# EAGLE design untitled (EAGLE 7.2.0)
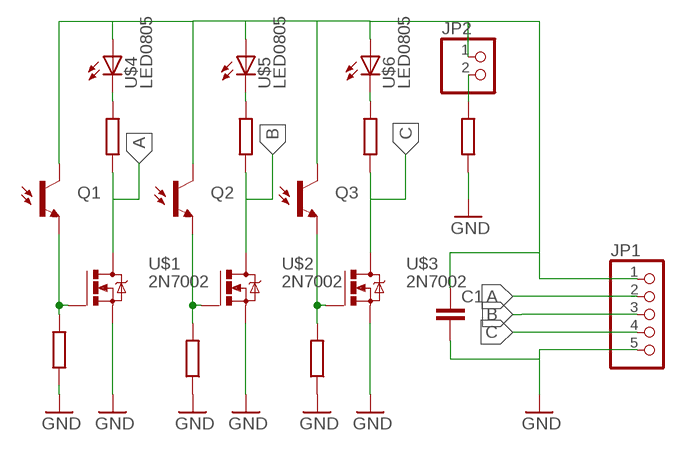
[diagram p0: schematic, sheet 1]

## Parts
C1  CC0805  [C0805]
JP1  PINHD-1X5  [1X05]
JP2  PINHD-1X2  [1X02]
Q1  PHOTOTRANSISTORPT17-21C-L41-TR8  [PT17-21C-L41-TR8]
Q2  PHOTOTRANSISTORPT17-21C-L41-TR8  [PT17-21C-L41-TR8]
Q3  PHOTOTRANSISTORPT17-21C-L41-TR8  [PT17-21C-L41-TR8]
R1  R0805  [R0805]
R4  R0805  [R0805]
R5  R0805  [R0805]
R6  R0805  [R0805]
R7  R0805  [R0805]
R8  R0805  [R0805]
R9  R0805  [R0805]
U$1  2N7002  [SOT23]
U$2  2N7002  [SOT23]
U$3  2N7002  [SOT23]
U$4  LED0805  [0805-LED]
U$5  LED0805  [0805-LED]
U$6  LED0805  [0805-LED]

## Nets
A: JP1.2 R7.1 U$1.3(D)
B: JP1.3 R8.1 U$2.3(D)
C: JP1.4 R9.1 U$3.3(D)
GND: C1.2 JP1.5 R1.1 R4.1 R5.1 R6.1 U$1.2(S) U$2.2(S) U$3.2(S)
N$3: C1.1 JP1.1 JP2.1 Q1.C Q2.C Q3.C U$4.A U$5.A U$6.A
N$4: Q1.E R4.2 U$1.1(G)
N$5: Q2.E R5.2 U$2.1(G)
N$6: Q3.E R6.2 U$3.1(G)
N$8: JP2.2 R1.2
N$11: R7.2 U$4.C
N$12: R8.2 U$5.C
N$13: R9.2 U$6.C

## Library data of the parts
C1 = CasaLibrary:C: Capacitor
JP1 = pinhead:PINHD-1X5: PIN HEADER
JP2 = pinhead:PINHD-1X2: PIN HEADER
Q1-Q3 = SparkFun-DiscreteSemi:PHOTOTRANSISTOR; PROD_ID: TRANS-12141
R1 R4-R9 = CasaLibrary:R
U$1-U$3 = CasaLibrary:2N7002
U$4-U$6 = CasaLibrary:LED

## Board
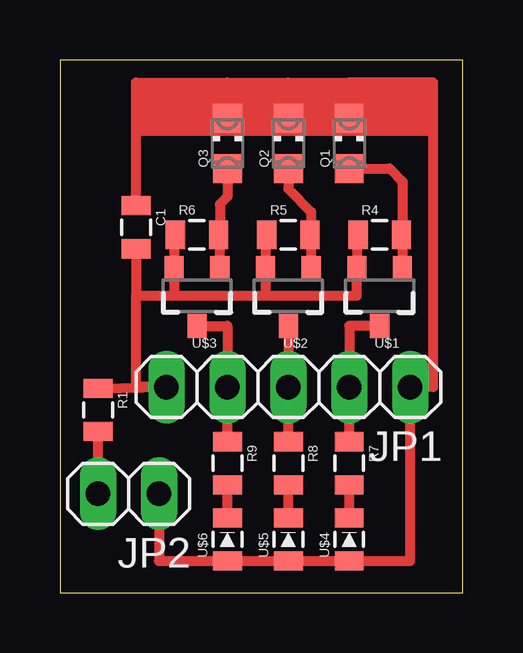
[diagram p1: board, top side]

Size 16.81 x 22.21 mm. Coordinates in mm from the lower left corner, seen from the top.
Outline: 0,0 16.81,0 16.81,22.21 0,22.21 0,0
Copper layers (1*16): Top 0.035mm / dielectric 1.5mm / Bottom 0.035mm
Design rules "my02": minimum track width 0.2mm, minimum drill 0.2mm, track to track 0.2mm, track to pad 0.2mm, pad to pad 0.2mm, via to via 0.2mm, smd to smd 0.2mm, copper to edge 40mil, drill to drill 8mil, minimum pad ring 10mil, minimum via ring 8mil, stop-mask expansion 4mil, vias tented up to drill 0mil, thermal gap 10mil

### Footprints (pad centres in the part's own frame; a part is rotated, then mirrored left to right if it is on the bottom)
C0805 = smd 0.8 x 1.2: 1 -0.9,0; 2 0.9,0
1X05 = drill 1.016 long: 1 -5.08,0; 2 -2.54,0; 3 0,0; 4 2.54,0; 5 5.08,0
1X02 = drill 1.016 long: 1 -1.27,0; 2 1.27,0
PT17-21C-L41-TR8 = smd 1.2 x 1.2: C 0,1.05; E 0,-1.05
R0805 = smd 0.8 x 1.2: 1 -0.9,0; 2 0.9,0
SOT23 = smd 0.8 x 1: 1 -0.95,-1.159; 2 0.95,-1.159; 3 0,1.259
0805-LED = smd 0.8 x 1.2: A -0.9,0; C 0.9,0

### Placement (x,y rotation side)
C1  3.17,15.24 270 top
JP1  9.53,8.57 180 top
JP2  2.86,4.13 180 top
Q1  12.06,18.73 0 top
Q2  9.53,18.73 0 top
Q3  6.99,18.73 0 top
R1  1.59,7.62 270 top
R4  13.34,14.92 0 top
R5  9.53,14.92 0 top
R6  5.71,14.92 0 top
R7  12.06,5.4 270 top
R8  9.53,5.4 270 top
R9  6.99,5.4 270 top
U$1  13.34,12.38 180 top
U$2  9.53,12.38 180 top
U$3  5.71,12.38 180 top
U$4  12.06,2.22 90 top
U$5  9.53,2.22 90 top
U$6  6.99,2.22 90 top

### Tracks (layer width: path | path; a pad name or v marks a point on that pad's centre or on a via)
A
  Top 0.406: R7.1 JP1.2 12.06,11.12 U$1.3
B
  Top 0.406: R8.1 JP1.3 U$2.3
C
  Top 0.406: R9.1 JP1.4 6.99,11.12 U$3.3
GND
  Top 0.406: R6.1 4.76,14.92 U$3.2 4.76,12.38 | R5.1 8.57,14.92 U$2.2 8.57,12.38 | R4.1 12.38,14.92 U$1.2 12.38,12.38 8.57,12.38 | 3.17,12.38 3.17,8.57 JP1.5 R1.1 | 3.17,12.38 4.76,12.38 | 4.76,12.38 8.57,12.38 | C1.2 3.17,12.38
N$3
  Top 0.406: Q3.C 6.99,21.27 | 6.99,21.27 9.53,21.27 | Q2.C 9.53,21.27 | 9.53,21.27 12.06,21.27 | 12.06,21.27 Q1.C | 12.06,21.27 15.56,21.27 15.56,8.57 JP1.1 14.61,1.32 U$4.A U$5.A U$6.A 4.13,1.32 JP2.1 | C1.1 3.17,21.27 6.99,21.27
N$4
  Top 0.406: U$1.1 14.29,14.92 R4.2 14.29,14.97 14.29,17.14 13.75,17.68 Q1.E
N$5
  Top 0.406: Q2.E 9.89,17.68 9.53,17.31 9.53,16.83 10.48,15.88 10.48,14.97 R5.2 | R5.2 10.47,14.92 U$2.1 | R5.2 10.43,15.29
N$6
  Top 0.406: U$3.1 6.67,14.92 R6.2 6.67,14.97 6.67,16.19 6.99,16.51 Q3.E
N$8
  Top 0.406: JP2.2 R1.2
N$11
  Top 0.406: U$4.C R7.2
N$12
  Top 0.406: U$5.C R8.2
N$13
  Top 0.406: U$6.C R9.2
(copper drawn outside any net)
  shapes: Top area x1